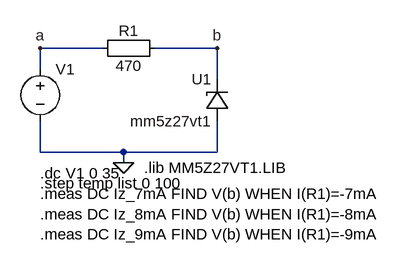
[diagram p0: schematic zener_va_27v.asc]
zener_va_27v.asc, the LTspice schematic file:
Version 4
SHEET 1 880 680
WIRE 112 -256 16 -256
WIRE 288 -256 192 -256
WIRE 16 -224 16 -256
WIRE 288 -208 288 -256
WIRE 16 -96 16 -144
WIRE 144 -96 16 -96
WIRE 288 -96 288 -144
WIRE 288 -96 144 -96
WIRE 144 -80 144 -96
FLAG 144 -80 0
FLAG 16 -256 a
FLAG 288 -256 b
SYMBOL Misc\\EuropeanResistor 208 -272 R90
WINDOW 0 5 56 VBottom 2
WINDOW 3 27 56 VTop 2
SYMATTR InstName R1
SYMATTR Value 470
SYMBOL zener-macro-model 304 -144 R180
WINDOW 0 24 64 Left 2
WINDOW 3 24 0 Left 2
SYMATTR InstName U1
SYMATTR Value mm5z27vt1
SYMBOL voltage 16 -240 R0
SYMATTR InstName V1
SYMATTR Value ""
TEXT 16 -64 Left 2 !.dc V1 0 35
TEXT 16 -48 Left 2 !.step temp list 0 100
TEXT 176 -72 Left 2 !.lib MM5Z27VT1.LIB
TEXT 16 -32 Left 2 !.meas DC Iz_7mA FIND V(b) WHEN I(R1)=-7mA\n.meas DC Iz_8mA FIND V(b) WHEN I(R1)=-8mA\n.meas DC Iz_9mA FIND V(b) WHEN I(R1)=-9mA

The netlist it stands for:
* zener_va_27v.asc
R1 b a 470
XU1 0 b mm5z27vt1  ; pins + -
V1 a 0
.dc V1 0 35
.step temp list 0 100
.lib MM5Z27VT1.LIB
.meas DC Iz_7mA FIND V(b) WHEN I(R1)=-7mA
.meas DC Iz_8mA FIND V(b) WHEN I(R1)=-8mA
.meas DC Iz_9mA FIND V(b) WHEN I(R1)=-9mA
.backanno
.end